# Altium schematic sheet devre.SchDoc
size A4
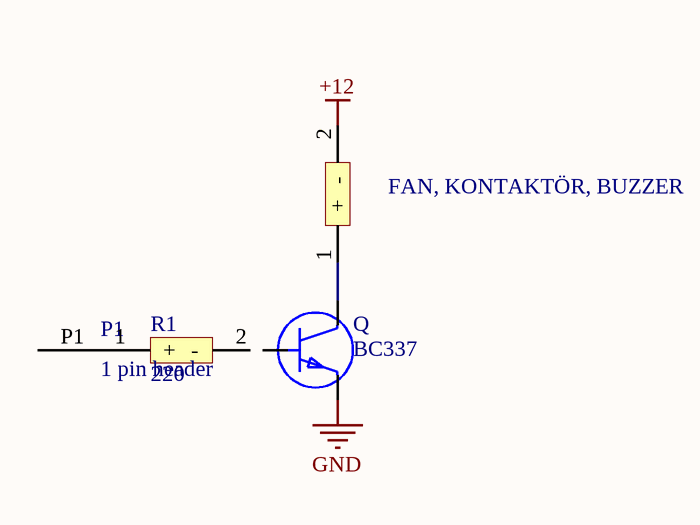
[diagram p0: devre.SchDoc]

## Parts
FAN,_KONTAKTÖR,_BUZZER  100 resistor  [100 resistor]  (value not drawn)
P1  1 pin header  [1pinheader]
Q  BC337  [TO-92R]
R1  220  [100 resistor]

## Nets
+12: FAN,_KONTAKTÖR,_BUZZER.2(-)
GND: Q.1(E)
NetFAN,_KONTAKTÖR,_BUZZER_1: FAN,_KONTAKTÖR,_BUZZER.1(+) Q.3(C)
NetP1_P1: P1.P1 R1.1(+)

Not connected (* = marked no-connect by the designer): Q 2(B); R1 2(-)

## Library data of the parts
Q = BC337: Bipolar (BJT) Transistor NPN 45V 800mA 100MHz 625mW Through Hole TO-92-3; MF: ON Semiconductor; Availability: Unavailable; Package: TO-92 ON Semiconductor; MP: BC337; SnapEDA_Link: https://www.snapeda.com/parts/BC337/ON%20Semiconductor/view-part/2772334/?ref=snap; Value: *; Price: None
R1 = 100 resistor